# EAGLE schematic brick_analog_temp_smd (EAGLE 7.3.0)
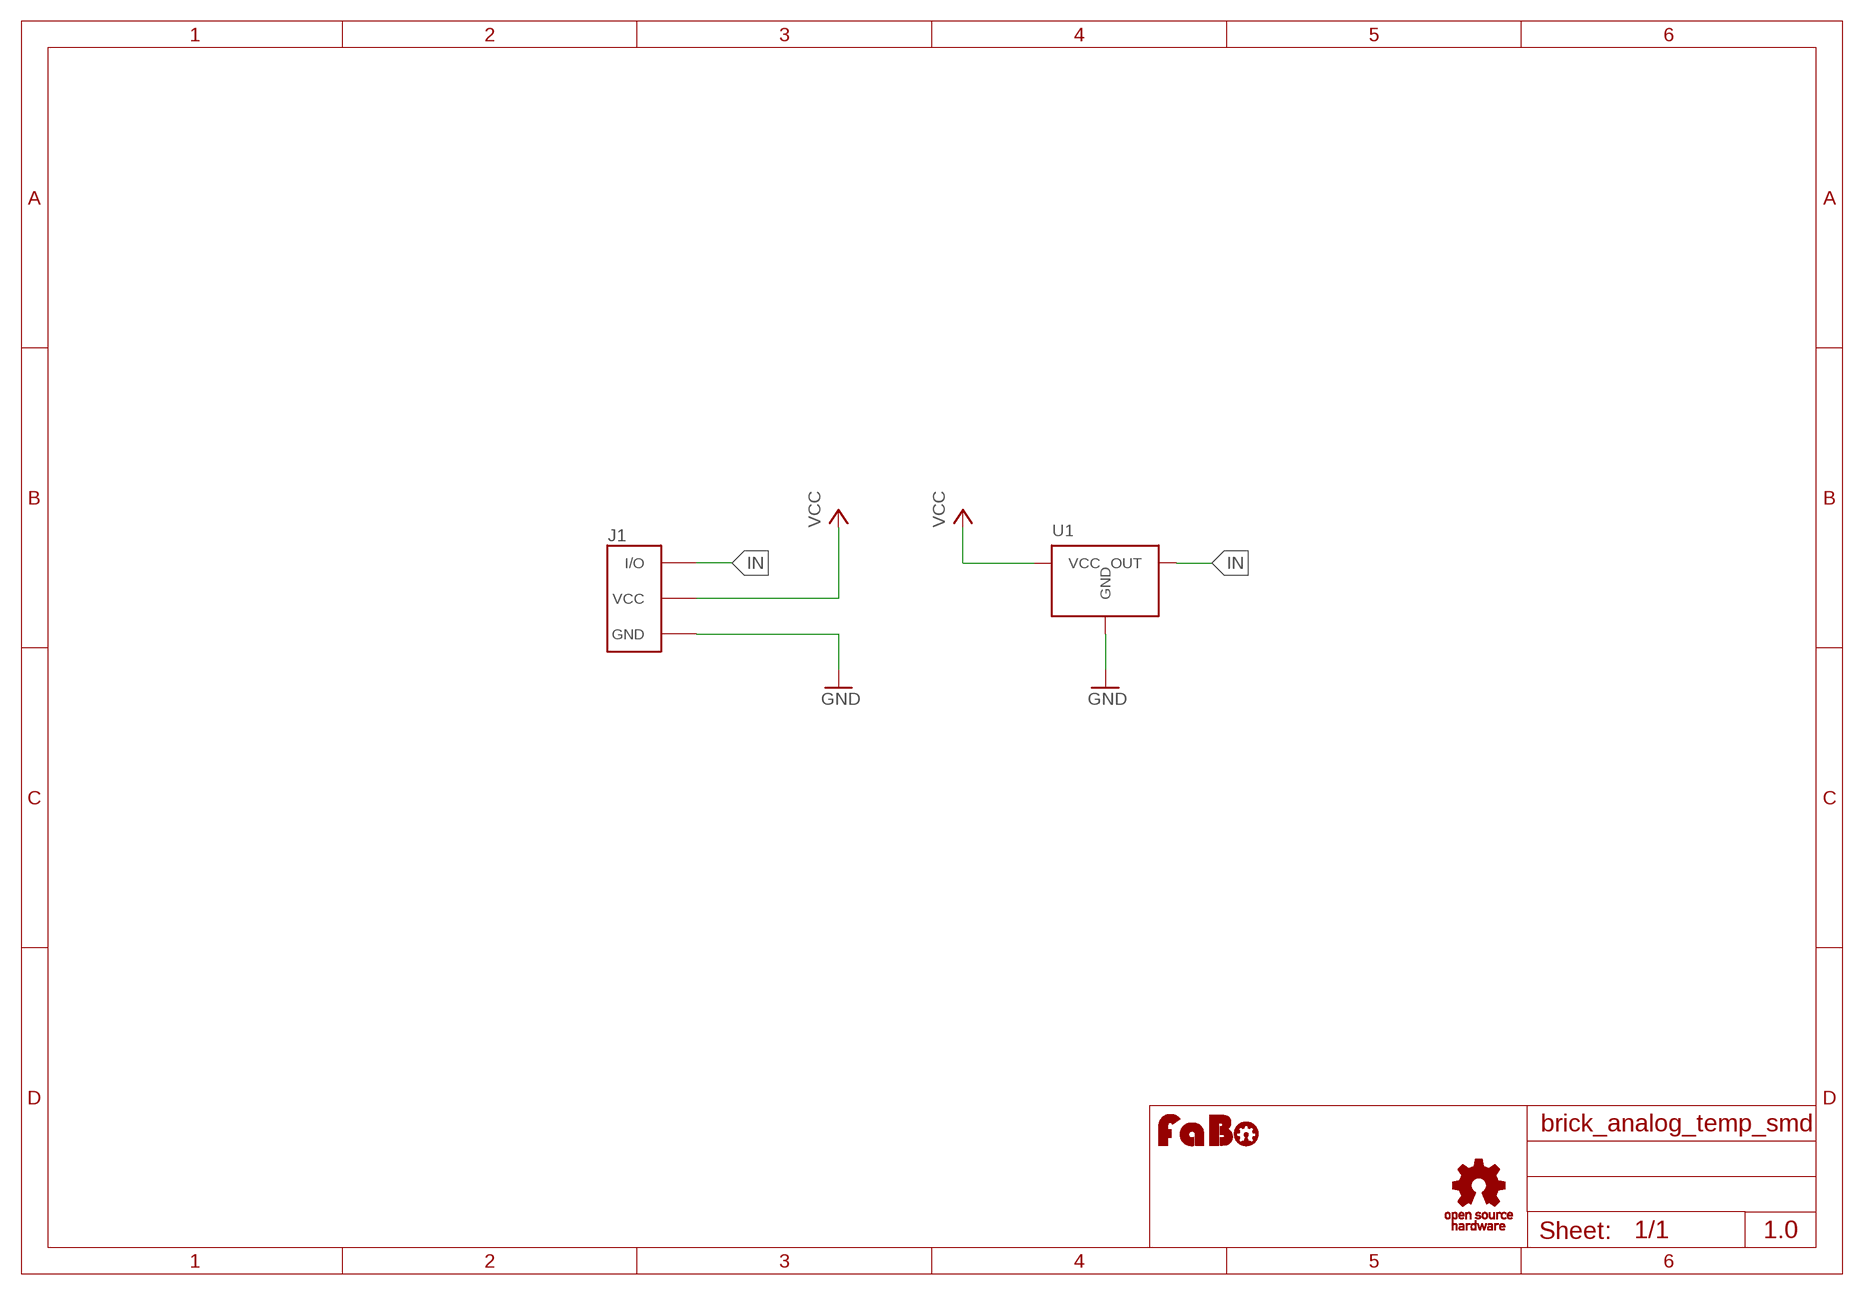
[diagram p0: schematic, sheet 1]

## Parts
J1  BRICK_3PIN_NORMAL  [BRICK_3PIN]
U1  SENSOR-LM60-SOT  [SENSOR-LM60-SOT-23]
U$2  LOGO_OSHW_T-M  [LOGO_OSHW_T_M]
U$3  LOGO_FABO-M  [LOGO_FABO_M]

## Nets
GND: J1.GND U1.GND
IN: J1.IN/OUT(I/O) U1.OUT
VCC: J1.VCC U1.VCC

## Notes on the sheet
- 1.0

## Library data of the parts
J1 = Gclue:BRICK_3PIN: FaBo Brick 3pin
U1 = Gclue:SENSOR-LM60-: LM60 Temperature Sensor
U$2 = Gclue:LOGO_OSHW_T
U$3 = FaBo:LOGO_FABO